# Altium schematic sheet Main.SchDoc: Linefollower-Main
size A3; Author: Patryk Bujak; DrawnBy: Patryk Bujak; DocumentNumber: 12; Revision: 1.0; SheetNumber: 1; SheetTotal: 10
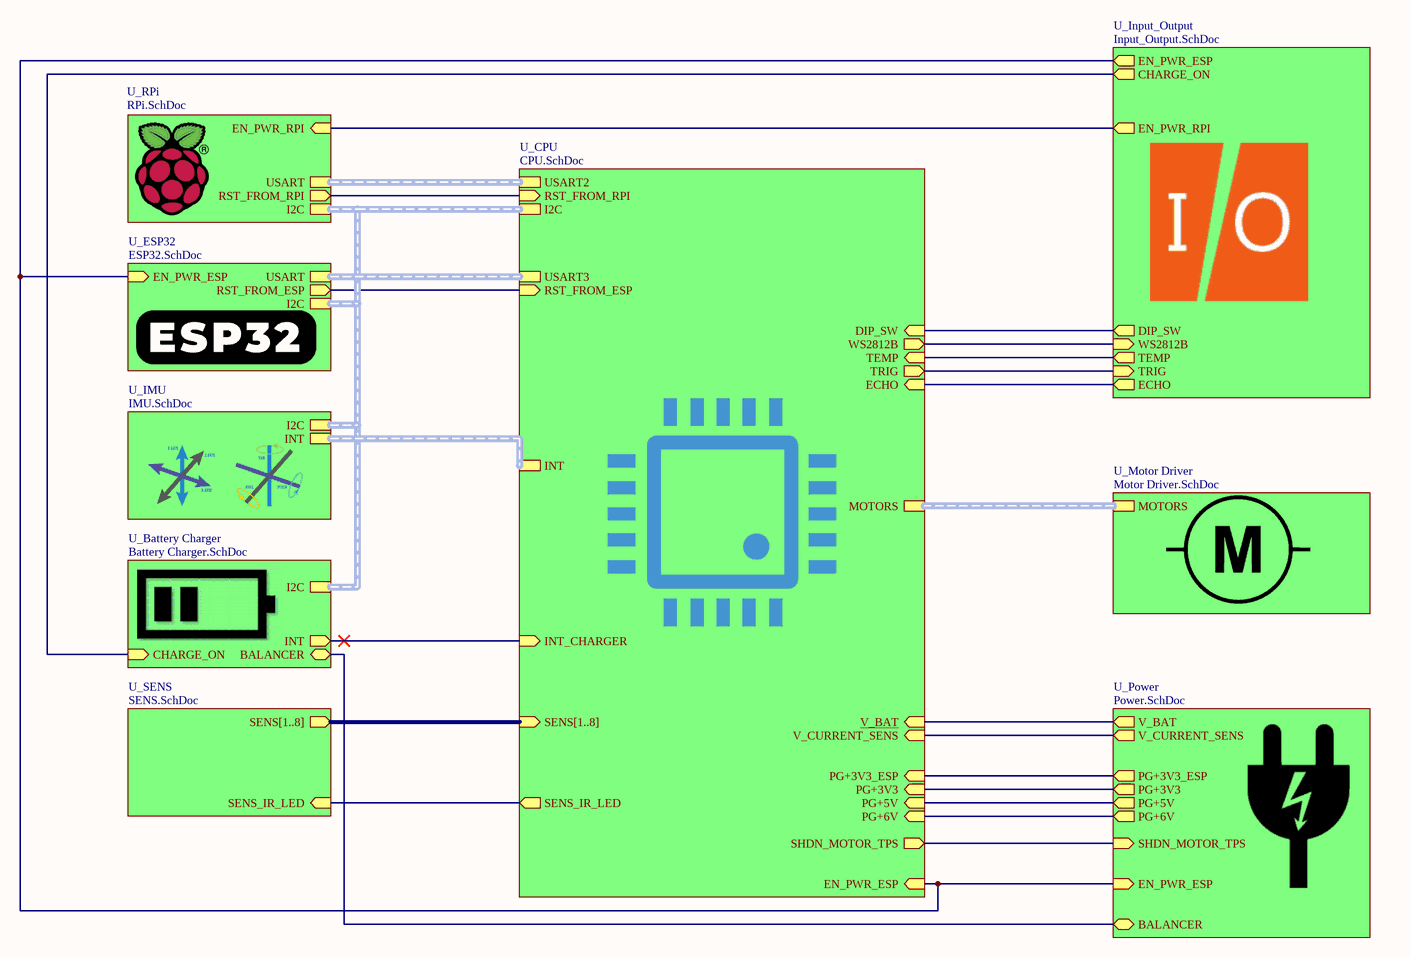
[diagram p0: Main.SchDoc]

## Sub-sheets
U_Battery Charger = Battery Charger.SchDoc: CHARGE_ON (in), INT (out), BALANCER (bidir), I2C (harness I2C)
U_CPU = CPU.SchDoc: SENS[1..8] (in), SHDN_MOTOR_TPS (out), PG+3V3_ESP (in), PG+6V (in), PG+5V (in), PG+3V3 (in), SENS_IR_LED (out), TRIG (out), ECHO (in), TEMP (in), WS2812B (out), DIP_SW (in), V_CURRENT_SENS (in), V_BAT (in), EN_PWR_ESP (in), INT_CHARGER (in), RST_FROM_ESP (in), RST_FROM_RPI (in), MOTORS (harness MOTORS), I2C (harness I2C), INT (harness INT), USART3 (harness USART3), USART2 (harness USART2)
U_ESP32 = ESP32.SchDoc: EN_PWR_ESP (in), RST_FROM_ESP (out), I2C (harness I2C), USART (harness UART)
U_IMU = IMU.SchDoc: I2C (harness I2C), INT (harness INT)
U_Input_Output = Input_Output.SchDoc: WS2812B (in), TRIG (in), ECHO (out), TEMP (out), CHARGE_ON (out), DIP_SW (out), EN_PWR_ESP (out), EN_PWR_RPI (out)
U_Motor Driver = Motor Driver.SchDoc: MOTORS (harness MOTORS)
U_Power = Power.SchDoc: SHDN_MOTOR_TPS (in), PG+6V (out), PG+5V (out), PG+3V3 (out), PG+3V3_ESP (out), EN_PWR_ESP (in), V_CURRENT_SENS (out), V_BAT (out), BALANCER (bidir)
U_RPi = RPi.SchDoc: EN_PWR_RPI (in), RST_FROM_RPI (out), I2C (harness I2C), USART (harness UART2)
U_SENS = SENS.SchDoc: SENS[1..8] (out), SENS_IR_LED (in)

## Nets
(unnamed): sheet U_SENS/SENS_IR_LED, sheet U_CPU/SENS_IR_LED
(unnamed): sheet U_Power/SHDN_MOTOR_TPS, sheet U_CPU/SHDN_MOTOR_TPS
(unnamed): sheet U_Power/PG+6V, sheet U_CPU/PG+6V
(unnamed): sheet U_Power/PG+5V, sheet U_CPU/PG+5V
(unnamed): sheet U_Power/PG+3V3, sheet U_CPU/PG+3V3
(unnamed): sheet U_Power/PG+3V3_ESP, sheet U_CPU/PG+3V3_ESP
(unnamed): sheet U_Power/EN_PWR_ESP, sheet U_CPU/EN_PWR_ESP, sheet U_ESP32/EN_PWR_ESP, sheet U_Input_Output/EN_PWR_ESP
(unnamed): sheet U_Power/V_CURRENT_SENS, sheet U_CPU/V_CURRENT_SENS
(unnamed): sheet U_Power/V_BAT, sheet U_CPU/V_BAT
(unnamed): sheet U_Power/BALANCER, sheet U_Battery Charger/BALANCER
(unnamed): sheet U_CPU/TRIG, sheet U_Input_Output/TRIG
(unnamed): sheet U_CPU/ECHO, sheet U_Input_Output/ECHO
(unnamed): sheet U_CPU/TEMP, sheet U_Input_Output/TEMP
(unnamed): sheet U_CPU/WS2812B, sheet U_Input_Output/WS2812B
(unnamed): sheet U_CPU/DIP_SW, sheet U_Input_Output/DIP_SW
(unnamed): sheet U_CPU/INT_CHARGER, sheet U_Battery Charger/INT
(unnamed): sheet U_CPU/RST_FROM_ESP, sheet U_ESP32/RST_FROM_ESP
(unnamed): sheet U_CPU/RST_FROM_RPI, sheet U_RPi/RST_FROM_RPI
(unnamed): sheet U_RPi/EN_PWR_RPI, sheet U_Input_Output/EN_PWR_RPI
(unnamed): sheet U_Input_Output/CHARGE_ON, sheet U_Battery Charger/CHARGE_ON

## Buses and harness runs
bus sheet U_CPU/SENS[1..8] = sheet U_SENS/SENS[1..8]
harness sheet U_Battery Charger/I2C = sheet U_CPU/I2C = sheet U_ESP32/I2C = sheet U_IMU/I2C = sheet U_RPi/I2C
harness sheet U_CPU/INT = sheet U_IMU/INT
harness sheet U_CPU/MOTORS = sheet U_Motor Driver/MOTORS
harness sheet U_CPU/USART2 = sheet U_RPi/USART
harness sheet U_CPU/USART3 = sheet U_ESP32/USART

## Notes on the sheet
- Title
- Size:
- Date:
- A3
- Number:
- Time:
- Revision:
- Sheet
- of
- File: